# Altium schematic sheet Inputs_Fast.SchDoc
size A4; SheetNumber: 5; SheetTotal: 7
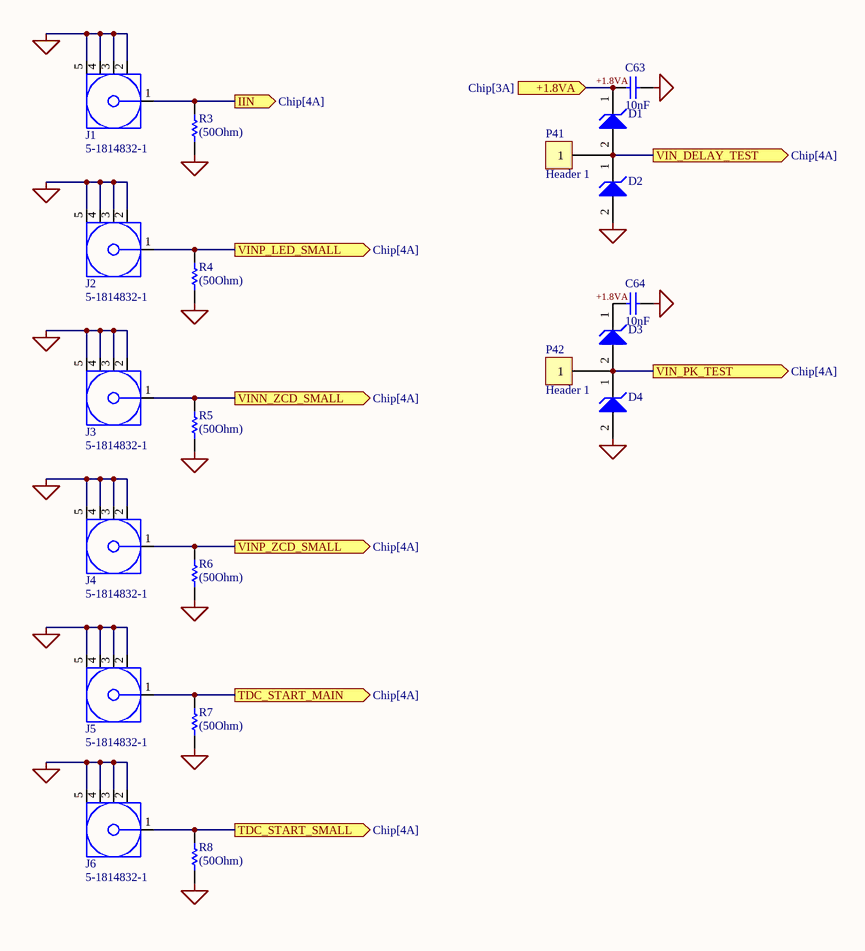
[diagram p0: Inputs_Fast.SchDoc]

## Parts
C63  10nF  [CAPC1608X90X35ML10T15]
C64  10nF  [CAPC1608X90X35ML10T15]
D1  (no value)  [ONSC-SOD-123-2-425-04_V]
D2  (no value)  [ONSC-SOD-123-2-425-04_V]
D3  (no value)  [ONSC-SOD-123-2-425-04_V]
D4  (no value)  [ONSC-SOD-123-2-425-04_V]
J1  5-1814832-1  [TECO-5-1814832-1_V]
J2  5-1814832-1  [TECO-5-1814832-1_V]
J3  5-1814832-1  [TECO-5-1814832-1_V]
J4  5-1814832-1  [TECO-5-1814832-1_V]
J5  5-1814832-1  [TECO-5-1814832-1_V]
J6  5-1814832-1  [TECO-5-1814832-1_V]
P41  Header 1  [Header1]
P42  Header 1  [Header1]
R3  (50Ohm)  [RESC1609X50X30NL8T20]
R4  (50Ohm)  [RESC1609X50X30NL8T20]
R5  (50Ohm)  [RESC1609X50X30NL8T20]
R6  (50Ohm)  [RESC1609X50X30NL8T20]
R7  (50Ohm)  [RESC1609X50X30NL8T20]
R8  (50Ohm)  [RESC1609X50X30NL8T20]

## Ports
+1.8VA (in, see Chip[3A]), IIN (out, see Chip[4A]), TDC_START_MAIN (out, see Chip[4A]), TDC_START_SMALL (out, see Chip[4A]), VIN_DELAY_TEST (out, see Chip[4A]), VIN_PK_TEST (out, see Chip[4A]), VINN_ZCD_SMALL (out, see Chip[4A]), VINP_LED_SMALL (out, see Chip[4A]), VINP_ZCD_SMALL (out, see Chip[4A])

## Nets
GND: C63.1 C64.1 D2.2(A) D4.2(A) J1.2 J1.3 J1.4 J1.5 J2.2 J2.3 J2.4 J2.5 J3.2 J3.3 J3.4 J3.5 J4.2 J4.3 J4.4 J4.5 J5.2 J5.3 J5.4 J5.5 J6.2 J6.3 J6.4 J6.5 R3.1 R4.1 R5.1 R6.1 R7.1 R8.1
+1.8VA: C63.2 C64.2 D1.1(K) D3.1(K) ; port +1.8VA
IIN: J1.1 R3.2 ; port IIN
TDC_START_MAIN: J5.1 R7.2 ; port TDC_START_MAIN
TDC_START_SMALL: J6.1 R8.2 ; port TDC_START_SMALL
VIN_DELAY_TEST: D1.2(A) D2.1(K) P41.1 ; port VIN_DELAY_TEST
VIN_PK_TEST: D3.2(A) D4.1(K) P42.1 ; port VIN_PK_TEST
VINN_ZCD_SMALL: J3.1 R5.2 ; port VINN_ZCD_SMALL
VINP_LED_SMALL: J2.1 R4.2 ; port VINP_LED_SMALL
VINP_ZCD_SMALL: J4.1 R6.2 ; port VINP_ZCD_SMALL

## Library data of the parts
C63 C64 = CMP-2000-04945-1: 0603; Manufacturer: Murata; Capacitance: 22pF; Tolerance (%): ±5%; Rated Voltage: 50V; Dielectric: C0G; Manufacturer URL: http://www.murata.com/; Datasheet Version: Jul-06; Package Reference: 603; Case Size/Dimension: 0603; Package Description: 2-Pin Surface Mount Device, Body 1.6 x 0.8 mm; Datasheet URL: https://datasheet.ciiva.com/11786/0900766b807a1cab-11786398.pdf
D1-D4 = CMP-1060-00509-1: Zener Voltage Regulator, 2-Pin SOD-123, Pb-Free, Tape and Reel; Manufacturer: On Semiconductor; PartNumber: MMSZ4679T1G; P Max (W): 0.5; VZ Typ (V): 2; Packing: Tape and Reel; ComponentLink1Description: Manufacturer URL; DatasheetVersion: Rev. 9; PackageReference: SOD-123-2-425-04; ComponentLink3URL: http://www.onsemi.com/pub_link/Collateral/425-04.PDF; PackageDescription: 2-Pin SOD, Body 1.6 x 2.69 mm; ComponentLink3Description: Package Specification; ComponentLink2Description: Datasheet; ComponentLink1URL: http://www.onsemi.com/; RoHS: Pb-Free; PackageVersion: Rev. G, 10/2009; ComponentLink2URL: http://www.onsemi.com/pub_link/Collateral/MMSZ4678T1-D.PDF; Mounting Technology: Surface Mount
J1-J6 = CMP-2000-05415-1: SMA Connector, Pitch 5.08 mm, 1 Position, Height 9.5 mm, Tail Length 4 mm, -65 to 165 degC, RoHS, Bulk; Manufacturer: TE Connectivity; Connector Mounting: PCBMount; Connector Body Style: StraightJack; Impedance: 50ohm; Coaxial Termination: Solder; SVHC: NoSVHC(15-Jun-2015); Frequency Max: 3GHz; Product Range: ZDCSeries; Connector Type: SMACoaxial; Datasheet Version: Rev. B1, 03/2011; Package Reference: 5-1814832-1; Package Description: SMA Connector, Pitch 5.08 mm, 1 Position, Height 9.5 mm, Tail Length 4 mm; Contact Plating: GoldPlatedContacts; Coaxial Cable Types: -; Contact Material: BerylliumCopper; Manufacturer URL: http://www.te.com/; Datasheet URL: http://www.onlinecomponents.com/productFiles/mf-AMP/eng_cd_1814832_a.pdf
R3-R8 = CMP-2000-03816-5: 0603; Manufacturer: Vishay Semiconductor; Voltage Rating: 75 V; Package Quantity: 5000; DatasheetVersion: 06/2012; Min Operating Temperature: -55 degC; ComponentLink1URL: http://www.vishay.com/; Mounting Technology: Surface Mount; Height: 0.45 mm; ComponentLink1Description: Manufacturer URL; REACH SVHC: Unknown; PackageReference: 0603; Packaging: Tape and Reel; Max Operating Temperature: 155 degC; Mount: Surface Mount; ComponentLink2Description: Datasheet; PackageDescription: 2-Pin Surface Mount Device, Body 1.575 x 0.85 mm; Length: 1.55 mm; ComponentLink2URL: http://www.vishay.com/docs/20035/dcrcwe3.pdf; Pins: 2; RoHSCompliant: true